# EasyEDA Pro project Logic Connector V1.1.1.epro

# Schematic Version 1.1.1

## Sheets
1 Mode Select: Board Name: <System Assignment>; Create Date: 2025-01-27; Page Name: Mode Select; Project Name: Access Control Logic Connector; Schematic Name: Version 1.0.1; Update Date: 2025-06-26
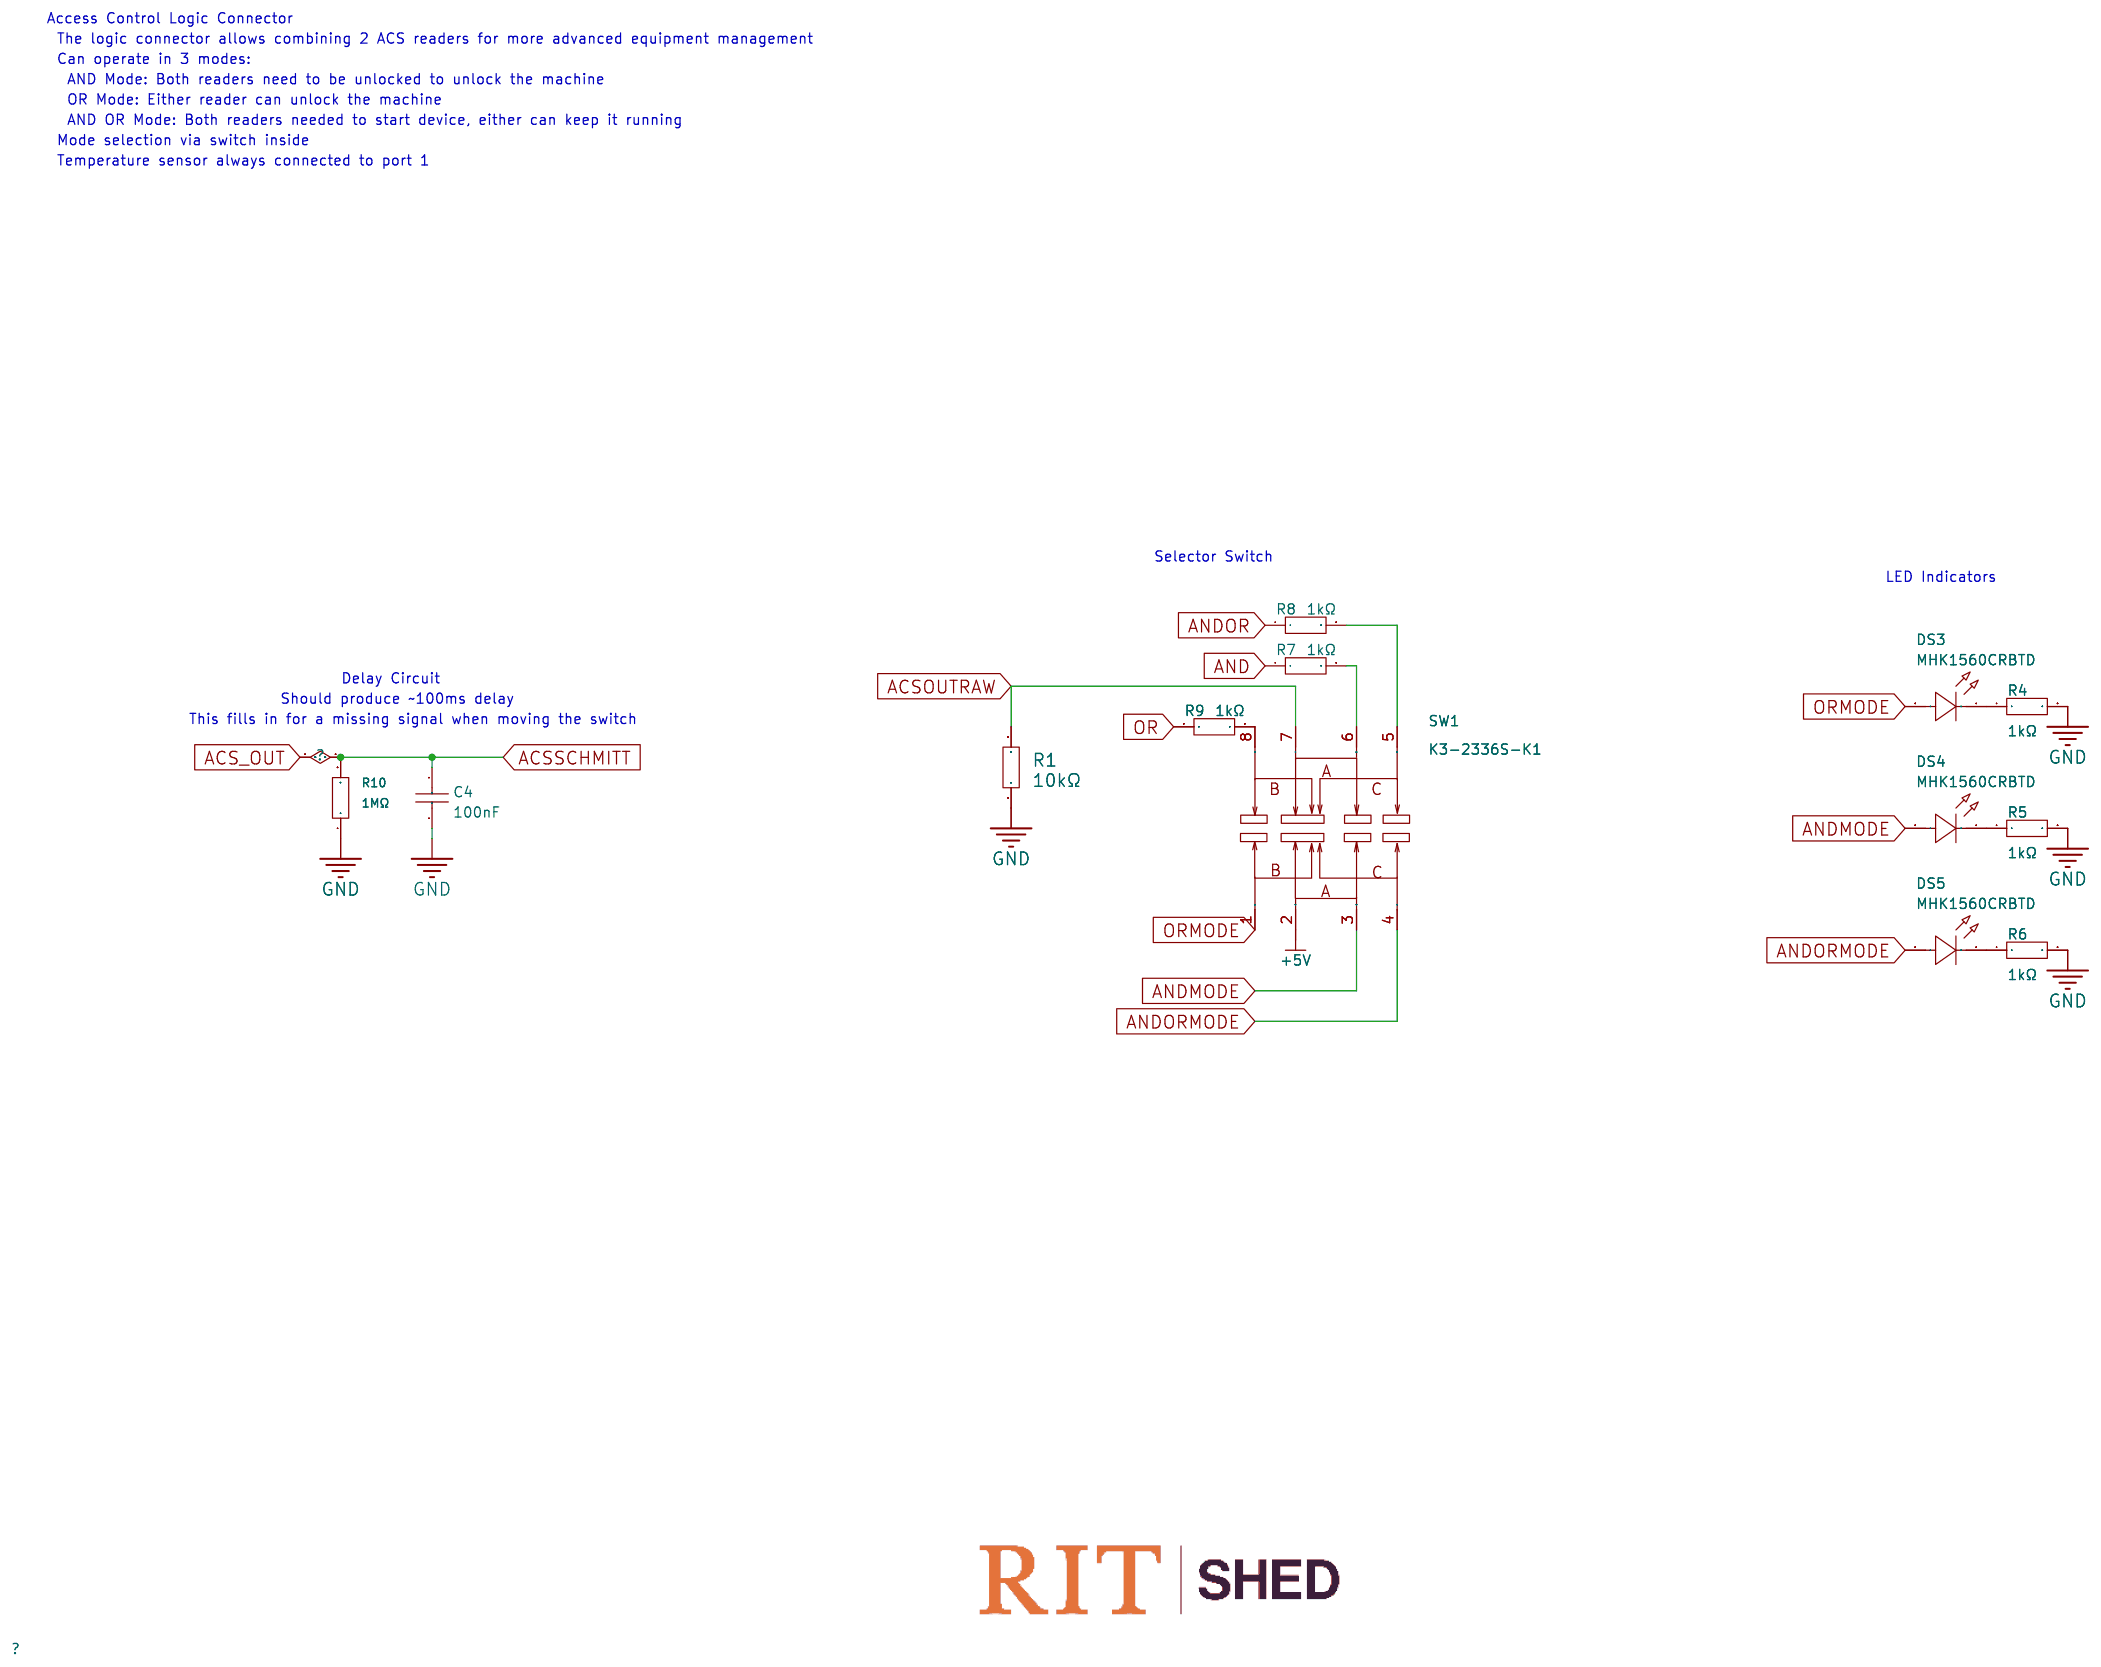
[diagram p0: Mode Select]
2 Connectors: Board Name: Board1; Create Date: 2025-01-28; Page Name: Connectors
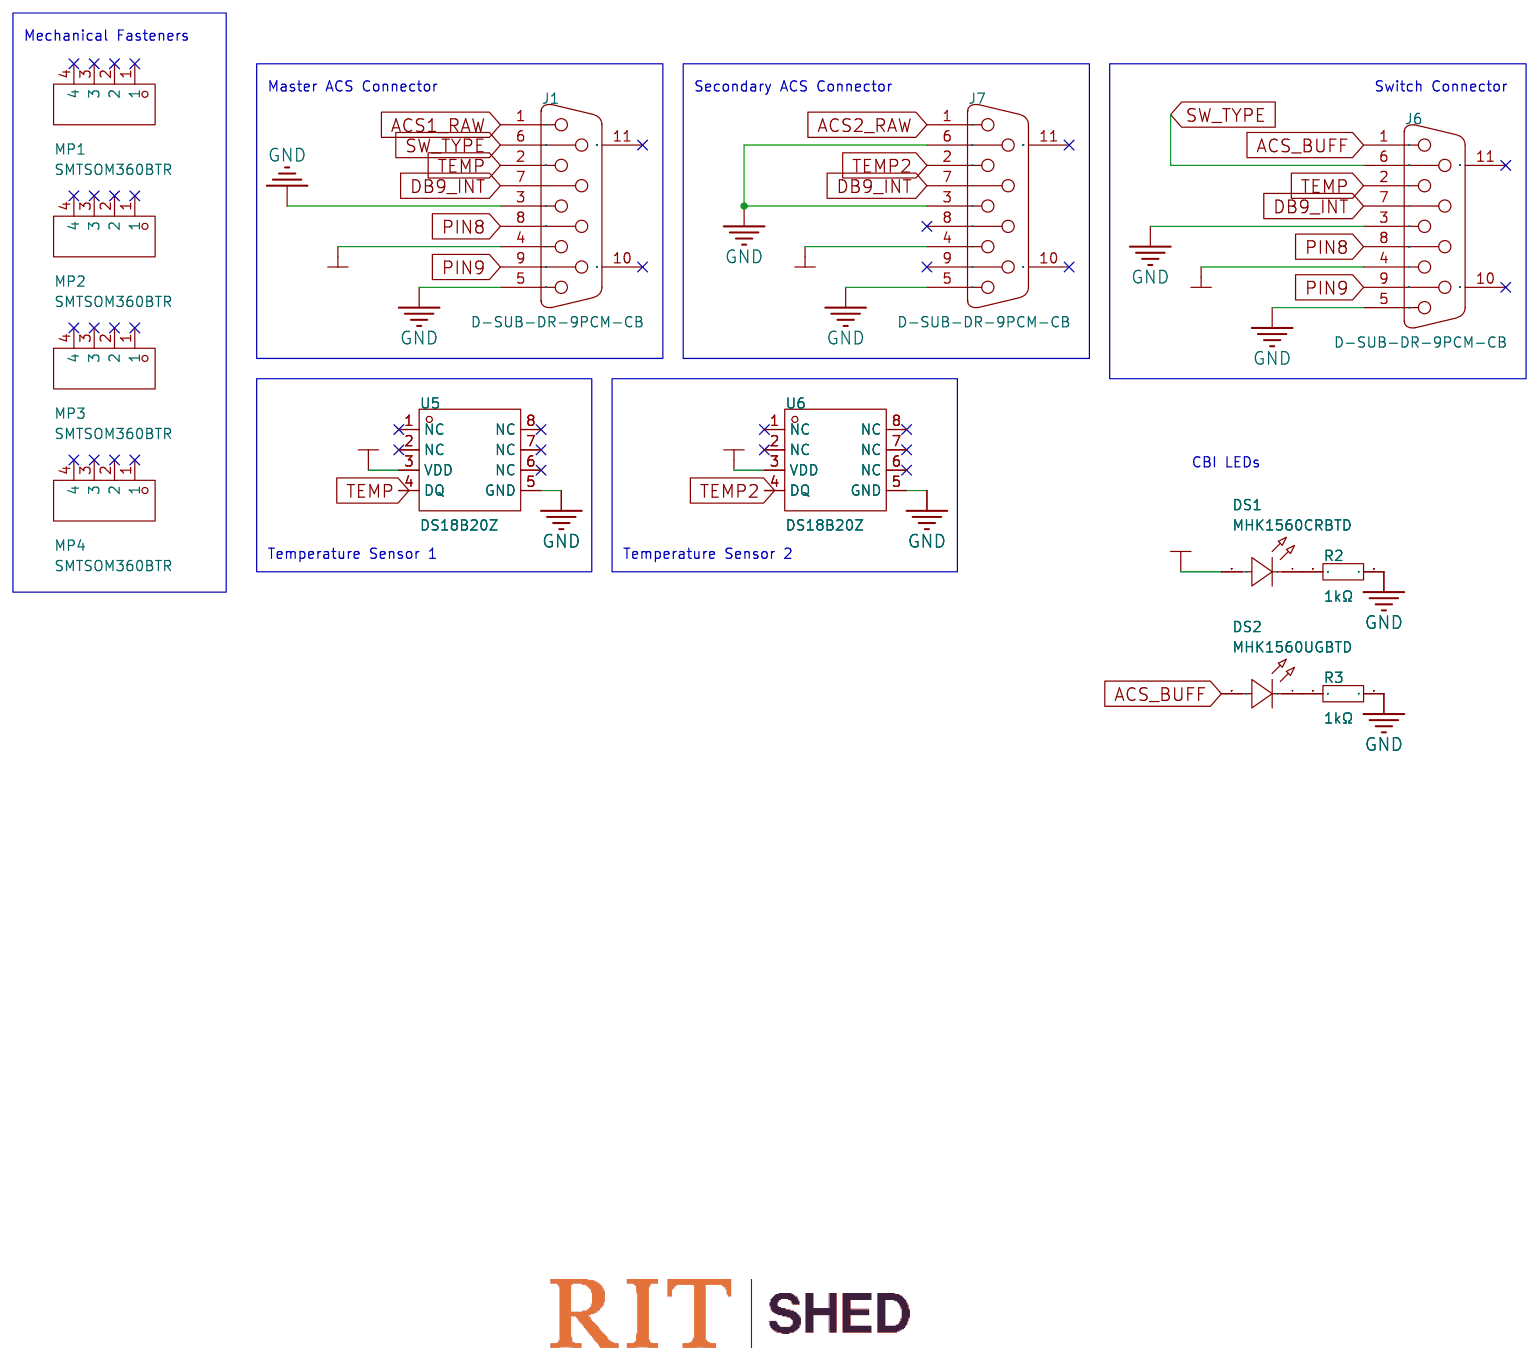
[diagram p1: Connectors]
3 Logic: Board Name: Board1; Create Date: 2025-01-28; Page Name: Logic
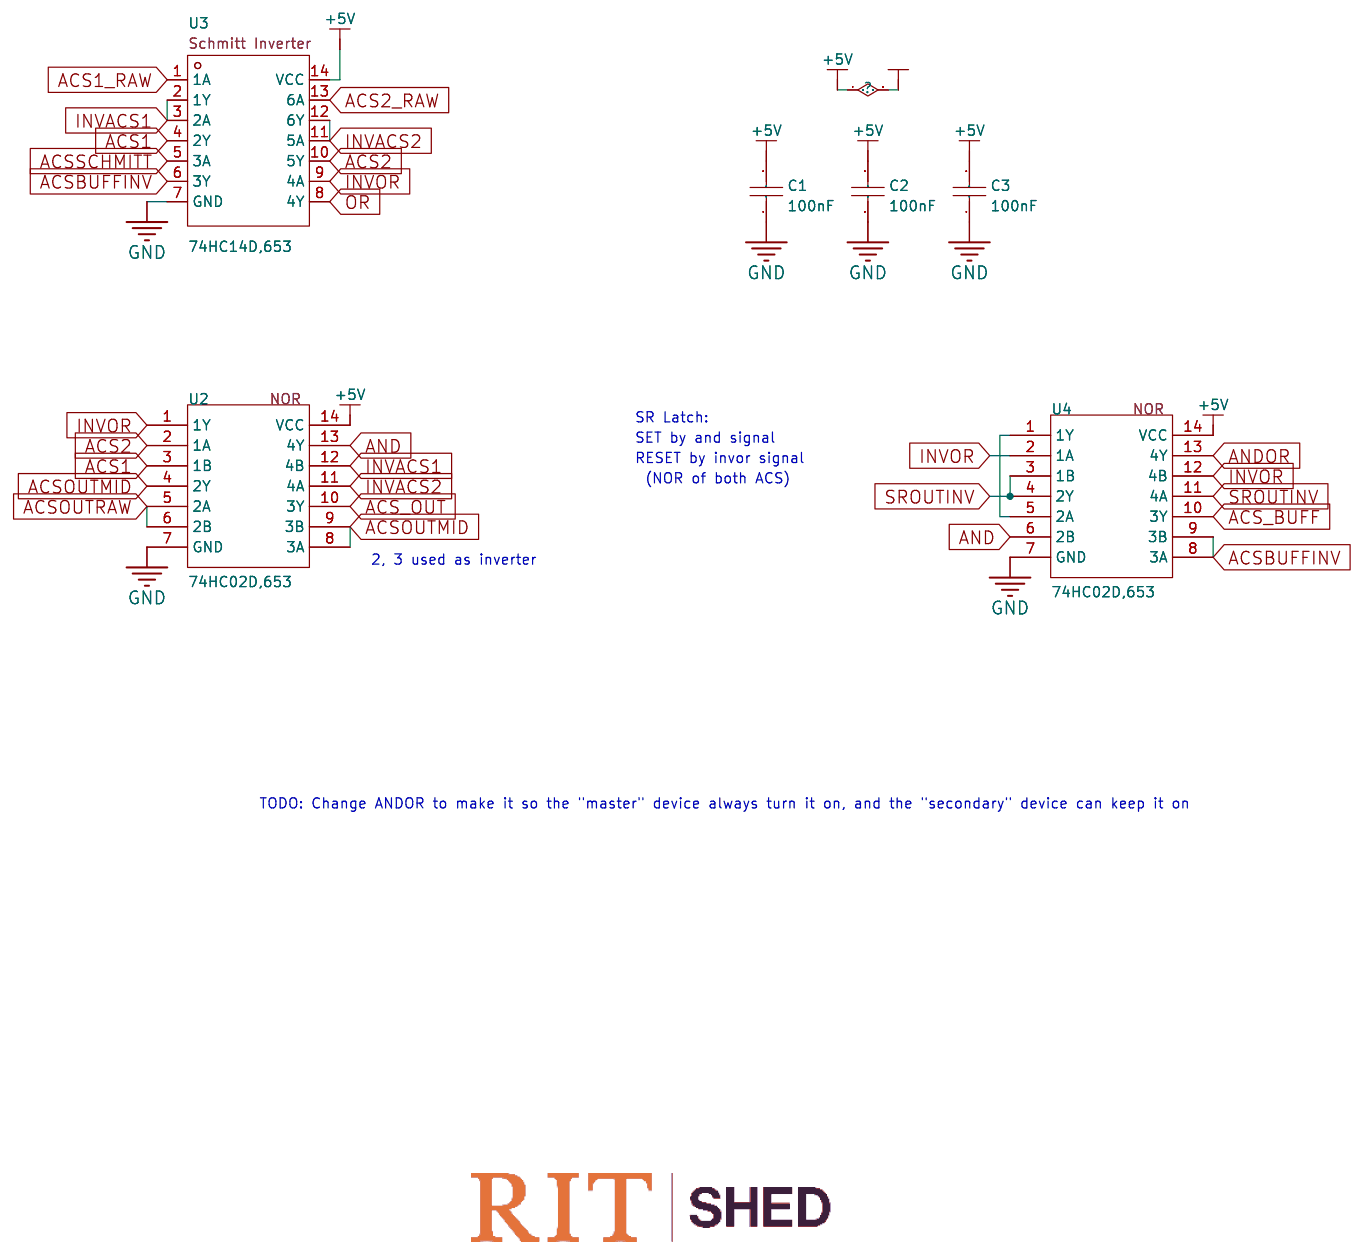
[diagram p2: Logic]

## Parts
sheet Connectors
DS1  MHK1560CRBTD  [LED-TH_MHK1560UGBTD]
DS2  MHK1560UGBTD  [LED-TH_MHK1560UGBTD]
J1  D-SUB-DR-9PCM-CB  [DB9-TH_D-SUB-DR-9PCM-CB]
J6  D-SUB-DR-9PCM-CB  [DB9-TH_D-SUB-DR-9PCM-CB]
J7  D-SUB-DR-9PCM-CB  [DB9-TH_D-SUB-DR-9PCM-CB]
MP1  SMTSOM360BTR  [SMD_BD5.6-D4.1]
MP2  SMTSOM360BTR  [SMD_BD5.6-D4.1]
MP3  SMTSOM360BTR  [SMD_BD5.6-D4.1]
MP4  SMTSOM360BTR  [SMD_BD5.6-D4.1]
R2  1kΩ  [R0805]
R3  1kΩ  [R0805]
U5  DS18B20Z  [SOP-8_L4.9-W3.9-P1.27-LS6.0-BL]
U6  DS18B20Z  [SOP-8_L4.9-W3.9-P1.27-LS6.0-BL]
sheet Logic
C1  100nF  [C0805]
C2  100nF  [C0805]
C3  100nF  [C0805]
U2  74HC02D,653  [SOIC-14_L8.7-W3.9-P1.27-LS6.0-BL]
U3  74HC14D,653  [SOIC-14_L8.7-W3.9-P1.27-LS6.0-BL]
U4  74HC02D,653  [SOIC-14_L8.7-W3.9-P1.27-LS6.0-BL]
sheet Mode Select
C4  100nF  [C0805]
DS3  MHK1560CRBTD  [LED-TH_MHK1560UGBTD]
DS4  MHK1560CRBTD  [LED-TH_MHK1560UGBTD]
DS5  MHK1560CRBTD  [LED-TH_MHK1560UGBTD]
R1  10kΩ  [R0805]
R4  1kΩ  [R0805]
R5  1kΩ  [R0805]
R6  1kΩ  [R0805]
R7  1kΩ  [R0805]
R8  1kΩ  [R0805]
R9  1kΩ  [R0805]
R10  1MΩ  [R0805]
SW1  K3-2336S-K1  [SW-SMD_K3-2336S-K1]

## Library data of the parts
DS1 DS3-DS5 = MHK1560CGBTD: 20mA 雾状红透镜 50mcd -40℃~+85℃ 632nm Red 85° 1.75V~2.2V Plugin,P=2.54mm Light Emitting Diodes (LED) ROHS; LCSC Part Name: 1560直插单灯翠绿色光; Supplier Part: C7470835; Manufacturer: MEIHUA(美华); Supplier Footprint: 插件,P=2.54mm; JLCPCB Part Class: Extended Part; Datasheet: https://atta.szlcsc.com/upload/public/pdf/source/20231114/0151DB1F997DCF286213A722D08B4BAA.pdf; Supplier: LCSC; Emitted Color: Emerald; Forward Voltage (VF): 1.75V~2.2V; Forward Current: 20mA; Dominant Wavelength: 520nm; Lens Color: 雾状绿透镜; Luminous Intensity: 1000mcd; Viewing Angle: 85°; Operating Temperature: -40℃~+85℃
DS2 = MHK1560UGBTD: Emitted Color:Emerald Forward Voltage (VF):1.75V~2.2V Forward Voltage (VF):1.75V~2.2V Forward Current:20mA Dominant Wavelength:520nm Dominant Wavelength:520nm Lens Color:雾状绿透镜 Luminous Intensity:1000mcd Luminous Intensity:1000mcd Viewing Angle:85° Operati; LCSC Part Name: 1560直插单灯翠绿色光; Supplier Part: C7470833; Manufacturer: MEIHUA(美华); Supplier Footprint: 插件,P=2.54mm; JLCPCB Part Class: Extended Part; Datasheet: https://atta.szlcsc.com/upload/public/pdf/source/20231114/0151DB1F997DCF286213A722D08B4BAA.pdf; Supplier: LCSC; Emitted Color: Emerald; Forward Voltage (VF): 1.75V~2.2V; Forward Current: 20mA; Dominant Wavelength: 520nm; Lens Color: 雾状绿透镜; Luminous Intensity: 1000mcd; Viewing Angle: 85°; Operating Temperature: -40℃~+85℃
J1 J6 J7 = D-SUB-DR-9PCM-CB: Gender:Mother Number of Pins:9P Mounting Style:Bend-in Number of Rows:2 Current Rating-Signal (Max):3A Operating Temperature Range:-50℃~+105℃ Operating Temperature Range:-50℃~+105℃; LCSC Part Name: D-Sub 母 P数:9P; Supplier Part: C19077337; Manufacturer: XUNPU(讯普); Supplier Footprint: 弯插; JLCPCB Part Class: Extended Part; Datasheet: https://atta.szlcsc.com/upload/public/pdf/source/20231108/FB2E8AB0BE4F620DDF3F7F4D0B9AFB97.pdf; Supplier: LCSC; Gender: Mother; Number of Pins: 9P; Mounting Style: Bend-in; Number of Rows: 2; Operating Temperature Range: -50℃~+105℃; Current Rating-Signal (Max): 3A
MP1-MP4 = SMTSOM360BTR: LCSC Part Name: YIYUAN(怡远)M3贴片螺母 铜镀锡 PCB贴片连接器SMTSOM360BTR; Supplier Part: C5221846; Manufacturer: YIYUAN(怡远); JLCPCB Part Class: Extended Part; Datasheet: https://atta.szlcsc.com/upload/public/pdf/source/20230202/A42D22DA7D93D728E13784C4003E4077.pdf; Supplier: LCSC
R2-R9 = 0805W8F1001T5E: Type:Thick Film Resistors Resistance:1kΩ Tolerance:±1% Tolerance:±1% Power(Watts): Overload Voltage (Max): Temperature Coefficient:±100ppm/℃ Temperature Coefficient:±100ppm/℃ Operating Temperature Range:-55℃~+155℃ Operating Temperature Range:-55℃~+155℃; LCSC Part Name: 1kΩ ±1% 125mW 厚膜电阻; Supplier Part: C17513; Manufacturer: UNI-ROYAL(厚声); Supplier Footprint: 0805; Datasheet: https://atta.szlcsc.com/upload/public/pdf/source/20200306/C422600_1E6D84923E4A46A82E41ADD87F860B5C.pdf; Supplier: LCSC; Type: Thick Film Resistors; Tolerance: ±1%; Temperature Coefficient: ±100ppm/℃; Operating Temperature Range: -55℃~+155℃
U5 U6 = DS18B20Z: Resolution:±0.4℃ Resolution:±0.4℃ Supply Voltage:2.5V~5.5V Supply Voltage:2.5V~5.5V; LCSC Part Name: 温度传感器; Supplier Part: C695837; Manufacturer: UMW(友台半导体); Supplier Footprint: SOIC-8; JLCPCB Part Class: Extended Part; Datasheet: https://atta.szlcsc.com/upload/public/pdf/source/20231109/DC3DA9D47D486EF40A6E0F08B9A498E3.pdf; Supplier: LCSC; Resolution: ±0.4℃; Supply Voltage: 2.5V~5.5V
C1-C4 = CL21B104KCFNNNE: Capacitance: Tolerance:±10% Tolerance:±10% Voltage Rated: Temperature Coefficient:; LCSC Part Name: 100nF ±10% 100V; Supplier Part: C28233; Manufacturer: SAMSUNG(三星); Supplier Footprint: 0805; JLCPCB Part Class: Basic Part; Datasheet: https://atta.szlcsc.com/upload/public/pdf/source/20160218/1457707763339.pdf; Supplier: LCSC; Tolerance: ±10%
U2 U4 = 74HC02D,653: Logic Gate Type:NORGate Number of Channels:4 Supply Voltage:2V~6V Supply Voltage:2V~6V Quiescent Current (Max):2uA Sink Current:5.2mA Source Current:5.2mA High Level Range (VIH):1.5V~4.2V High Level Range (VIH):1.5V~4.2V Low Level Range (VIL):500mV~1.8V L; Supplier Part: C5588; Manufacturer: Nexperia(安世); Supplier Footprint: SOIC-14; Datasheet: https://atta.szlcsc.com/upload/public/pdf/source/20170225/1488010654689.pdf; Supplier: LCSC; Logic Gate Type: NOR; Number of Channels: 4; Supply Voltage: 2V~6V; Quiescent Current (Max): 2uA; Sink Current: 5.2mA; Source Current: 5.2mA; High Level Range (VIH): 1.5V~4.2V; Low Level Range (VIL): 500mV~1.8V; Series: 74HCSeries; Propagation Delay Time: 15ns@6V,50pF; Operating Temperature: -40℃~+125℃
U3 = 74HC14D,653: Input Type:Schmitt Trigger Supply Voltage(Single):2V~6V Supply Voltage(Single):2V~6V Supply Current (Max):2uA Number of Circuits:6 Number of Inputs:1 Sink Current:5.2mA Source Current:5.2mA High level range (VIH):1.5V~4.2V High level range (VIH):1.5V~4.2V; LCSC Part Name: 六路施密特触发反相器; Supplier Part: C5605; Manufacturer: Nexperia(安世); Supplier Footprint: SOIC-14; Datasheet: https://atta.szlcsc.com/upload/public/pdf/source/20240724/EDEB5B2454CA09835E17810C4B06A75D.pdf; Supplier: LCSC; Input Type: Schmitt Inverter; Supply Voltage(Single): 2V~6V; Supply Current (Max): 2uA; Number of Circuits: 6; Number of Inputs: 1; Sink Current: 5.2mA; Source Current: 5.2mA; High level range (VIH): 1.5V~4.2V; Low level range (VIL): 300mV~1.2V; Max Propagation Delay: 21ns@6V,50pF; Series: 74HCSeries; Operating Temperature: -40℃~+125℃
R1 = 0805W8F1002T5E: Type:Thick Film Resistors Resistance:10kΩ Tolerance:±1% Tolerance:±1% Power(Watts): Overload Voltage (Max): Temperature Coefficient:±100ppm/℃ Temperature Coefficient:±100ppm/℃ Operating Temperature Range:-55℃~+155℃ Operating Temperature Range:-55℃~+155℃; LCSC Part Name: 10kΩ ±1% 125mW 厚膜电阻; Supplier Part: C17414; Manufacturer: UNI-ROYAL(厚声); Supplier Footprint: 0805; JLCPCB Part Class: Basic Part; Datasheet: https://atta.szlcsc.com/upload/public/pdf/source/20200306/C422600_1E6D84923E4A46A82E41ADD87F860B5C.pdf; Supplier: LCSC; Type: Thick Film Resistors; Tolerance: ±1%; Temperature Coefficient: ±100ppm/℃; Operating Temperature Range: -55℃~+155℃
R10 = 0805W8F1004T5E: Type:Thick Film Resistors Resistance:1MΩ Tolerance:±1% Tolerance:±1% Power(Watts): Overload Voltage (Max): Temperature Coefficient:±100ppm/℃ Temperature Coefficient:±100ppm/℃ Operating Temperature Range:-55℃~+155℃ Operating Temperature Range:-55℃~+155℃; LCSC Part Name: 1MΩ ±1% 125mW 厚膜电阻; Supplier Part: C17514; Manufacturer: UNI-ROYAL(厚声); Supplier Footprint: 0805; Datasheet: https://atta.szlcsc.com/upload/public/pdf/source/20200306/C422600_1E6D84923E4A46A82E41ADD87F860B5C.pdf; Supplier: LCSC; Type: Thick Film Resistors; Tolerance: ±1%; Temperature Coefficient: ±100ppm/℃; Operating Temperature Range: -55℃~+155℃
SW1 = K3-2336S-K1: Circuit:双刀三掷 Actuator Style:Rectangular columnar Pin Style:Gull Wing Switch Length:13mm Switch Width:3.5mm Switch Height:3.5mm Mounting Style:Brick nogging Actuator Color:Black Current Rating (DC):300mA Voltage Rating (DC):6V Current Rating (AC):- Voltage; LCSC Part Name: 立贴三档 滑动开关; Supplier Part: C145840; Manufacturer: 韩国韩荣; Supplier Footprint: SMD; Datasheet: https://atta.szlcsc.com/upload/public/pdf/source/20210810/38444E7D6D5CD92570837A6EA51AB202.pdf; Supplier: LCSC; Circuit: 双刀三掷; Actuator Style: Rectangular columnar; Pin Style: Gull Wing; Switch Length: 13mm; Switch Width: 3.5mm; Switch Height: 3.5mm; Mounting Style: Brick nogging; Actuator Color: Black; Current Rating (DC): 300mA; Voltage Rating (DC): 6V; Mechanical Life: 1万次; Operating Temperature: -25℃~+80℃

## Nets
+5V: C1.2 C2.2 C3.2 DS1.2(A) J1.4 J6.4 J7.4 SW1.2 U2.14(VCC) U3.14(VCC) U4.14(VCC) U5.3(VDD) U6.3(VDD)
GND: C1.1 C2.1 C3.1 C4.1 J1.3 J1.5 J6.3 J6.5 J7.3 J7.5 J7.6 R1.1 R2.2 R3.2 R4.2 R5.2 R6.2 R10.1 U2.7(GND) U3.7(GND) U4.7(GND) U5.5(GND) U6.5(GND)
ACS1: U2.3(1B) U3.4(2Y)
ACS1_RAW: J1.1 U3.1(1A)
ACS2: U2.2(1A) U3.10(5Y)
ACS2_RAW: J7.1 U3.13(6A)
ACS_BUFF: DS2.2(A) J6.1 U4.10(3Y)
ACSBUFFINV: U3.6(3Y) U4.8(3A) U4.9(3B)
ACSOUTMID: U2.4(2Y) U2.8(3A) U2.9(3B)
ACSOUTRAW: R1.2 SW1.7 U2.5(2A) U2.6(2B)
ACSSCHMITT: C4.2 R10.2 U2.10(3Y) U3.5(3A)
AND: R7.1 U2.13(4Y) U4.6(2B)
ANDMODE: DS4.2(A) SW1.3
ANDOR: R8.1 U4.13(4Y)
ANDORMODE: DS5.2(A) SW1.4
DB9_INT: J1.7 J6.7 J7.7
INVACS1: U2.12(4B) U3.2(1Y) U3.3(2A)
INVACS2: U2.11(4A) U3.11(5A) U3.12(6Y)
INVOR: U2.1(1Y) U3.9(4A) U4.2(1A) U4.12(4B)
OR: R9.1 U3.8(4Y)
ORMODE: DS3.2(A) SW1.1
PIN8: J1.8 J6.8
PIN9: J1.9 J6.9
SROUTINV: U4.3(1B) U4.4(2Y) U4.11(4A)
SW_TYPE: J1.6 J6.6
TEMP: J1.2 J6.2 U5.4(DQ)
TEMP2: J7.2 U6.4(DQ)
$1N429: R7.2 SW1.6
$1N435: R8.2 SW1.5
$1N896: DS3.1(K) R4.1
$1N1033: DS4.1(K) R5.1
$1N1123: DS5.1(K) R6.1
$1N1288: R9.2 SW1.8
$2N1571: DS1.1(K) R2.1
$2N1653: DS2.1(K) R3.1
$3N978: U4.1(1Y) U4.5(2A)

Not connected (* = marked no-connect by the designer): J1 10(MH1)* 11(MH2)*; J6 10(MH1)* 11(MH2)*; J7 8* 9* 10(MH1)* 11(MH2)*; MP1 1* 2* 3* 4*; MP2 1* 2* 3* 4*; MP3 1* 2* 3* 4*; MP4 1* 2* 3* 4*; U5 1(NC)* 2(NC)* 6(NC)* 7(NC)* 8(NC)*; U6 1(NC)* 2(NC)* 6(NC)* 7(NC)* 8(NC)*

## Notes on the sheets
sheet 1
- Access Control Logic Connector
- The logic connector allows combining 2 ACS readers for more advanced equipment management
- Can operate in 3 modes:
- AND Mode: Both readers need to be unlocked to unlock the machine
- OR Mode: Either reader can unlock the machine
- AND OR Mode: Both readers needed to start device, either can keep it running
- Mode selection via switch inside
- Temperature sensor always connected to port 1
- Selector Switch
- LED Indicators
- Delay Circuit
- Should produce ~100ms delay
- This fills in for a missing signal when moving the switch
sheet 2
- Mechanical Fasteners
- Master ACS Connector
- Secondary ACS Connector
- Switch Connector
- CBI LEDs
- Temperature Sensor 1
- Temperature Sensor 2
sheet 3
- SET by and signal
- SR Latch:
- RESET by invor signal
- (NOR of both ACS)
- 2, 3 used as inverter
- TODO: Change ANDOR to make it so the "master" device always turn it on, and the "secondary" device can keep it on

# Board V1.1.1 PCB
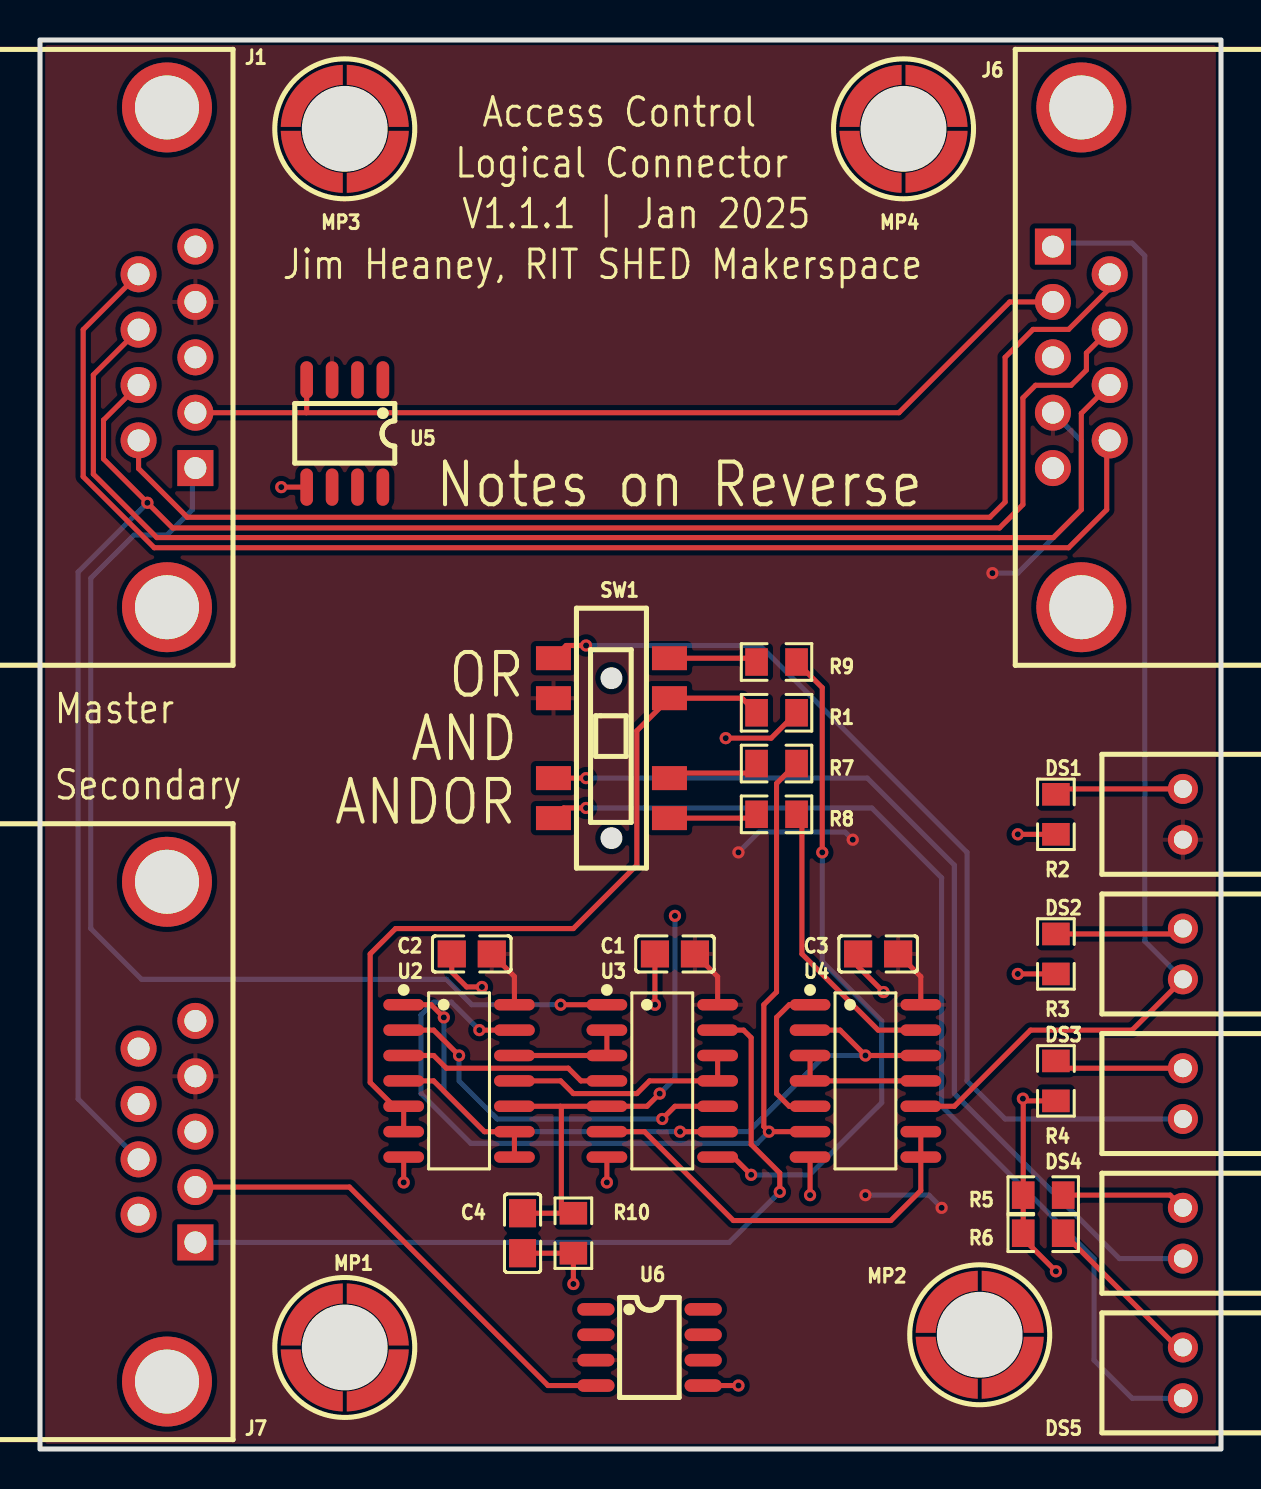
[diagram p3: board, top side]
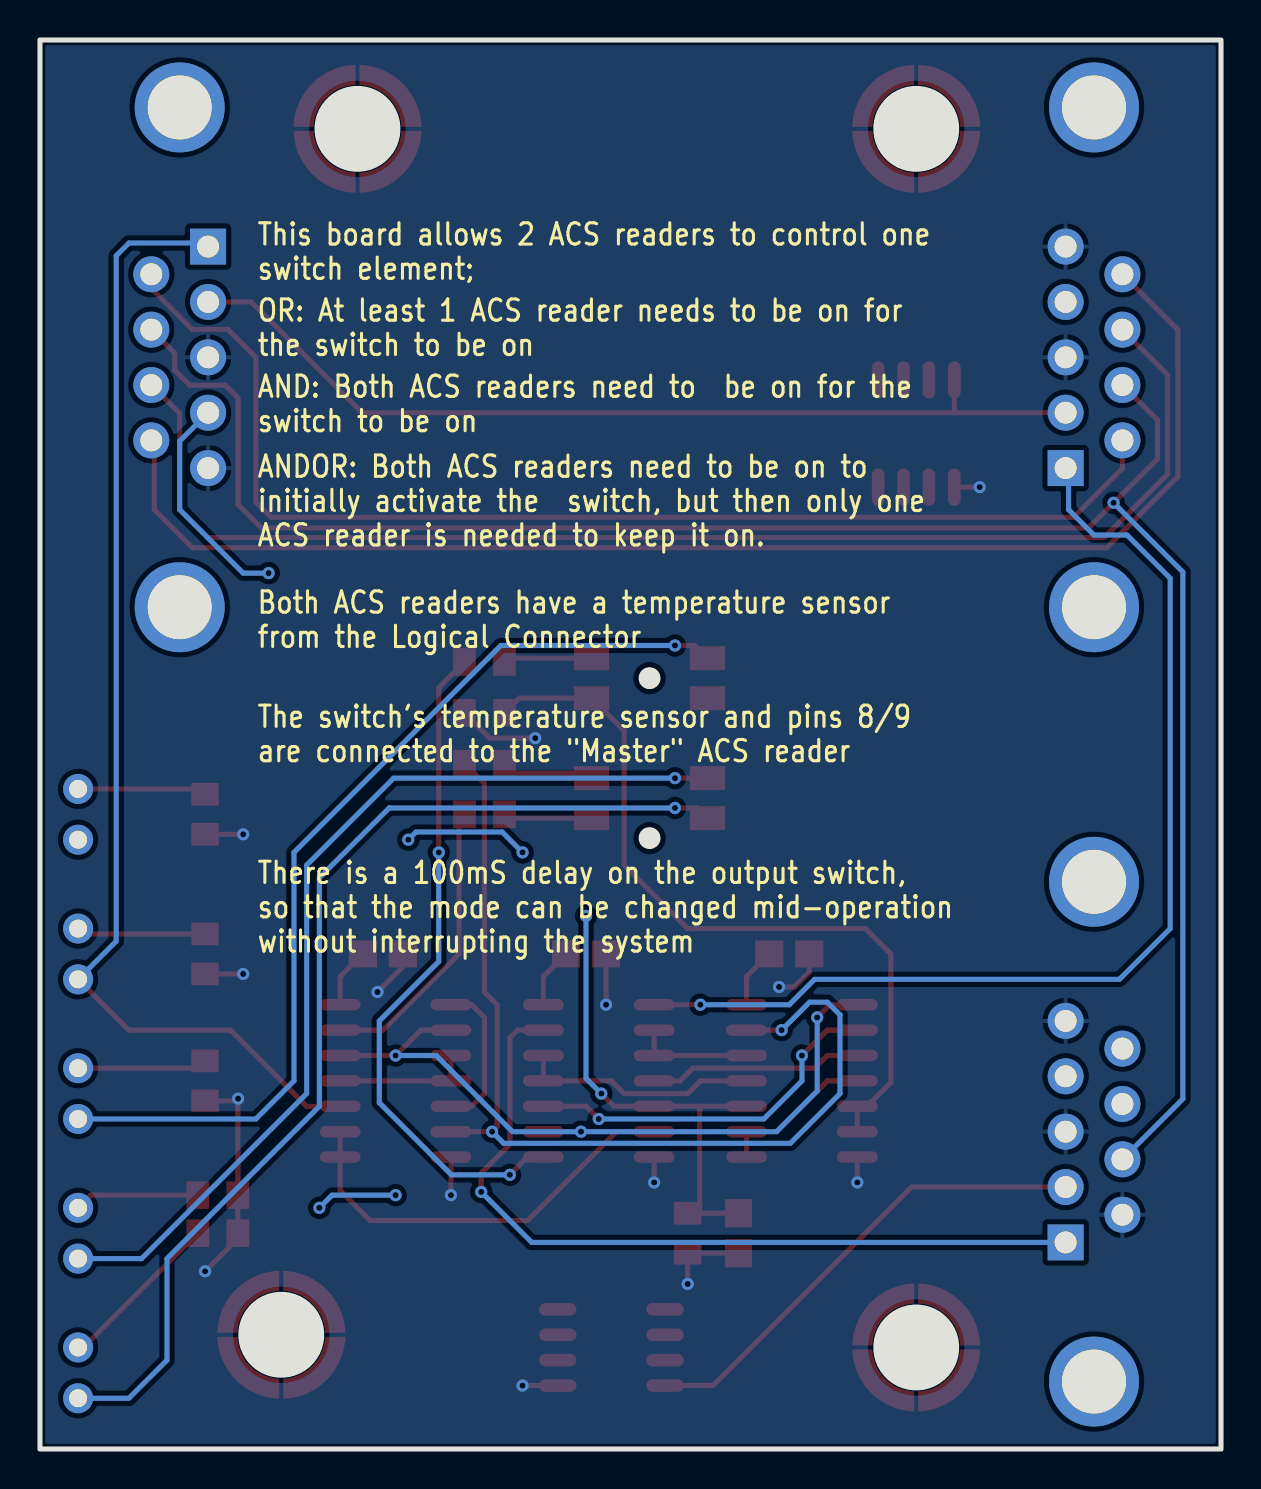
[diagram p4: board, bottom side, seen from below]

Outline 59.06 x 70.48 mm; copper layers: Top Layer, Bottom Layer. Coordinates in mm from the lower left corner of the outline.
Outline path: rectangle 0,70.48 59.06,0
Stack: Top Layer 0.035mm / Dielectric1 1.51mm FR4 er 4.5 / Bottom Layer 0.035mm

## Design rules (mm)
template: JLCPCB Capability(Two Layers Board)
spacing copperThickness1oz (default): track to track 0.102, other pairs 0.152 to 0.3
spacing copperThickness2oz: track to track 0.203, other pairs 0.152 to 0.3
track width copperThickness1oz (default): min 0.127, default 0.254, max 2.54
track width copperThickness2oz: min 0.203, default 0.254, max 2.54
differential pair differentialPair (default): width min 0.127, default 0.254, max 2.54; gap min 0.152, default 0.152
via viaSize (default): diameter min 0.5, default 0.61, max 10; hole min 0.3, default 0.305, max 6.3

## Placement (name value [footprint] x y rotation side)
C1  100nF  [C0805]  31.75 24.77 0 top
C2  100nF  [C0805]  21.59 24.77 0 top
C3  100nF  [C0805]  41.91 24.77 0 top
C4  100nF  [C0805]  24.13 10.79 90 top
DS1  MHK1560CRBTD  [LED-TH_MHK1560UGBTD]  57.15 31.75 90 top
DS2  MHK1560UGBTD  [LED-TH_MHK1560UGBTD]  57.15 24.77 90 top
DS3  MHK1560CRBTD  [LED-TH_MHK1560UGBTD]  57.15 17.78 90 top
DS4  MHK1560CRBTD  [LED-TH_MHK1560UGBTD]  57.15 10.79 90 top
DS5  MHK1560CRBTD  [LED-TH_MHK1560UGBTD]  57.15 3.81 90 top
J1  D-SUB-DR-9PCM-CB  [DB9-TH_D-SUB-DR-9PCM-CB]  6.35 54.61 270 top
J6  D-SUB-DR-9PCM-CB  [DB9-TH_D-SUB-DR-9PCM-CB]  52.07 54.61 90 top
J7  D-SUB-DR-9PCM-CB  [DB9-TH_D-SUB-DR-9PCM-CB]  6.35 15.88 270 top
MP1  SMTSOM360BTR  [SMD_BD5.6-D4.1]  15.24 5.08 0 top
MP2  SMTSOM360BTR  [SMD_BD5.6-D4.1]  46.99 5.72 0 top
MP3  SMTSOM360BTR  [SMD_BD5.6-D4.1]  15.24 66.04 0 top
MP4  SMTSOM360BTR  [SMD_BD5.6-D4.1]  43.18 66.04 0 top
R1  10kΩ  [R0805]  36.83 36.83 180 top
R2  1kΩ  [R0805]  50.8 31.75 270 top
R3  1kΩ  [R0805]  50.8 24.77 270 top
R4  1kΩ  [R0805]  50.8 18.41 270 top
R5  1kΩ  [R0805]  50.16 12.7 180 top
R6  1kΩ  [R0805]  50.16 10.79 180 top
R7  1kΩ  [R0805]  36.83 34.29 180 top
R8  1kΩ  [R0805]  36.83 31.75 180 top
R9  1kΩ  [R0805]  36.83 39.37 180 top
R10  1MΩ  [R0805]  26.67 10.79 90 top
SW1  K3-2336S-K1  [SW-SMD_K3-2336S-K1]  28.58 35.56 270 top
U2  74HC02D,653  [SOIC-14_L8.7-W3.9-P1.27-LS6.0-BL]  20.96 18.41 270 top
U3  74HC14D,653  [SOIC-14_L8.7-W3.9-P1.27-LS6.0-BL]  31.12 18.41 270 top
U4  74HC02D,653  [SOIC-14_L8.7-W3.9-P1.27-LS6.0-BL]  41.28 18.41 270 top
U5  DS18B20Z  [SOP-8_L4.9-W3.9-P1.27-LS6.0-BL]  15.24 50.8 180 top
U6  DS18B20Z  [SOP-8_L4.9-W3.9-P1.27-LS6.0-BL]  30.48 5.08 270 top

## Footprints (pads in the part's own frame, mm; a bottom-side part is the same pattern mirrored in y, then rotated)
C0805
  rect 1.41x1.35 smd: 1(-1,0) 2(1,0)
DB9-TH_D-SUB-DR-9PCM-CB
  rect 1.8x1.8 hole 1.1: 1(5.54,1.42)
  round 1.8 hole 1.1: 2(2.77,1.42) 3(0,1.42) 4(-2.77,1.42) 5(-5.54,1.42) 6(4.155,-1.42) 7(1.385,-1.42) 8(-1.385,-1.42) 9(-4.155,-1.42)
  round 4.5 hole 3.2: 10(-12.5,0) 11(12.5,0)
LED-TH_MHK1560UGBTD
  round 1.5 hole 0.9: 1(1.27,0) 2(-1.27,0)
R0805
  rect 1.133x1.377 smd: 1(-1,0) 2(1,0)
SMD_BD5.6-D4.1
  custom 3.1x3.1 smd: 1(-2.102,1.65) 2(1.65,2.102) 3(2.102,-1.65) 4(-1.65,-2.102)
SOIC-14_L8.7-W3.9-P1.27-LS6.0-BL
  oval 0.574x2.038 smd: 1(-3.81,-2.769) 2(-2.54,-2.769) 3(-1.27,-2.769) 4(0,-2.769) 5(1.27,-2.769) 6(2.54,-2.769) 7(3.81,-2.769) 8(3.81,2.769) 9(2.54,2.769) 10(1.27,2.769) 11(0,2.769) 12(-1.27,2.769) 13(-2.54,2.769) 14(-3.81,2.769)
SOP-8_L4.9-W3.9-P1.27-LS6.0-BL
  oval 0.63x1.865 smd: 1(-1.905,-2.683) 2(-0.635,-2.683) 3(0.635,-2.683) 4(1.905,-2.683) 5(1.905,2.683) 6(0.635,2.683) 7(-0.635,2.683) 8(-1.905,2.683)
SW-SMD_K3-2336S-K1
  rect 1.2x1.75 smd: 1(-4,-2.9) 2(-2,-2.9) 3(2,-2.9) 4(4,-2.9) 5(4,2.9) 6(2,2.9) 7(-2,2.9) 8(-4,2.9)

## Nets
As in the schematic.

Pads without a net: J1 10 11; J6 10 11; J7 8 9 10 11; MP1 1 2 3 4; MP2 1 2 3 4; MP3 1 2 3 4; MP4 1 2 3 4; U5 1 2 6 7 8; U6 1 2 6 7 8

## Via types
v1: diameter 0.61, hole 0.305, Top Layer to Bottom Layer, 36 vias

## Routing (per net, layer and track width the routed paths; a pad name or vN(x,y) marks a point on that pad's centre or on a via; arc(x,y) is an arc through that point)
+5V: length 30.6
  Top Layer w0.254: U3.14 33.88,23.63 C1.2 ; U4.14 44.04,23.63 C3.2 ; C2.2 23.72,23.63 U2.14
  Bottom Layer w0.254: J6.4 52.07,50.42 52.07,46.99 48.9,43.81 v1(47.62,43.81) ; v1(40.64,30.48) 40.26,30.86 35.94,30.86 v1(34.93,29.84) ; v1(45.09,12.06) 44.45,12.7 v1(41.28,12.7)
GND: length 38.1
  Top Layer w0.254: C3.1 40.91,24.13 v1(42.18,22.86) ; v1(34.29,35.56) 36.56,35.56 R1.1 ; U2.7 v1(18.19,13.33) ; C4.1 R10.1 v1(26.67,8.25) ; C2.1 20.59,23.86 21.34,23.11 v1(22.1,23.11) ; U3.7 v1(28.35,13.33) ; R4.2 49.26,17.41 49.16,17.51 ; U4.7 v1(38.51,12.7) ; R2.2 v1(48.9,30.75) ; U6.5 v1(34.93,3.18) ; R3.2 v1(48.9,23.77) ; U5.5 v1(12.06,48.12) ; v1(50.8,8.89) 49.16,10.53 R6.2 R5.2 49.16,17.51 ; C1.1 v1(30.75,22.22) ; 49.16,17.51 v1(49.15,17.53)
ACS1: length 10.7
  Top Layer w0.254: U3.4 27.05,18.41 26.42,19.05 20.32,19.05 19.69,19.69 U2.3
ACS1_RAW: length 53.6
  Top Layer w0.254: U3.1 v1(26.03,22.22)
  Bottom Layer w0.254: J1.1 7.62,48.92 7.62,46.99 6.35,45.72 4.7,45.72 2.54,43.56 2.54,26.03 5.08,23.5 20.32,23.5 21.59,22.22 v1(26.03,22.22)
ACS2: length 18.5
  Top Layer w0.254: v1(20.96,19.69) 19.69,20.95 U2.2 ; U3.10 31.75,17.14 v1(31.12,16.51)
  Bottom Layer w0.254: v1(31.12,16.51) 22.86,16.51 20.96,18.41 v1(20.96,19.69)
ACS2_RAW: length 40.4
  Top Layer w0.254: U3.13 35.18,20.95 35.56,20.57 35.56,15.24 36.99,13.81 v1(36.99,12.86)
  Bottom Layer w0.254: v1(36.99,12.86) 34.47,10.34 J7.1
ACS_BUFF: length 57.7
  Top Layer w0.254: DS2.2 54.61,20.95 49.53,20.95 45.72,17.14 U4.10
  Bottom Layer w0.254: J6.1 50.83,60.33 54.61,60.33 55.25,59.69 55.25,25.4 DS2.2
ACSBUFFINV: length 21.1
  Top Layer w0.254: U4.9 U4.8 44.04,12.93 42.55,11.43 34.67,11.43 30.23,15.88 U3.6
ACSOUTMID: length 7.9
  Top Layer w0.254: U2.8 U2.9 22.22,15.88 19.69,18.41 U2.4
ACSOUTRAW: length 38.7
  Top Layer w0.254: R1.2 35.1,37.56 SW1.7 29.84,35.93 29.84,29.21 26.67,26.03 17.78,26.03 16.51,24.77 16.51,18.34 17.7,17.14 U2.5 U2.6
ACSSCHMITT: length 24.6
  Top Layer w0.254: 26.07,11.79 26.07,17.1 26.02,17.14 ; 26.07,11.79 R10.2 ; 26.07,11.79 C4.2 ; U2.10 26.02,17.14 ; 26.02,17.14 U3.5 30.35,17.14 v1(30.99,17.78)
  Bottom Layer w0.254: v1(30.99,17.78) 31.75,18.54 v1(31.75,26.67)
AND: length 49.4
  Top Layer w0.254: U4.6 v1(36.45,15.88) 36.19,16.13 36.19,22.22 36.83,22.86 36.83,33.29 R7.1 ; U2.13 v1(21.97,20.95)
  Bottom Layer w0.254: v1(36.45,15.88) 35.87,15.29 21.54,15.29 19.05,17.78 19.05,21.72 19.69,22.35 20.57,22.35 v1(21.97,20.95)
ANDMODE: length 48.1
  Top Layer w0.254: SW1.3 v1(27.31,33.56)
  Bottom Layer w0.254: DS4.2 53.97,9.53 45.72,17.78 45.72,29.21 41.37,33.56 v1(27.31,33.56)
ANDOR: length 14.6
  Top Layer w0.254: U4.13 41.91,20.95 38.1,24.77 38.1,31.48 R8.1
ANDORMODE: length 53.6
  Top Layer w0.254: v1(27.31,32.07) 26.18,32.07 SW1.4
  Bottom Layer w0.254: v1(27.31,32.07) 41.59,32.07 45.09,28.58 45.09,17.14 52.71,9.53 52.71,4.44 54.61,2.54 DS5.2
DB9_INT: length 99.4
  Top Layer w0.254: J6.7 52.32,54.83 52.32,53.97 51.56,53.21 49.78,53.21 49.15,52.58 49.15,47.24 47.98,46.08 6.63,46.08 v1(5.37,47.33) 3.18,49.53 3.18,51.47 J1.7
  Bottom Layer w0.254: v1(5.37,47.33) 1.91,43.87 1.91,17.52 J7.7
INVACS1: length 5.9
  Top Layer w0.254: U2.12 U3.3 U3.2
INVACS2: length 12
  Top Layer w0.254: U3.12 U3.11 30.48,18.41 29.84,17.78 26.67,17.78 26.03,18.41 U2.11
INVOR: length 37.4
  Top Layer w0.254: v1(32,15.88) U3.9 ; U4.12 v1(41.28,19.69) 40,20.95 U4.2 ; U2.1 19.56,22.22 v1(20.19,21.59)
  Bottom Layer w0.254: v1(41.28,19.69) 39.24,19.69 35.43,15.88 v1(32,15.88) 22.22,15.88 20.19,17.91 v1(20.19,21.59)
OR: length 33.9
  Top Layer w0.254: v1(35.56,13.72) 34.67,14.61 U3.8 ; R9.1 39.12,38.08 v1(39.12,29.84)
  Bottom Layer w0.254: v1(39.12,29.84) 39.12,24.38 42.09,21.41 42.09,17.32 38.48,13.72 v1(35.56,13.72)
ORMODE: length 48.2
  Top Layer w0.254: SW1.1 26.31,40.19 v1(27.31,40.19)
  Bottom Layer w0.254: DS3.2 48.26,16.51 46.36,18.41 46.36,29.84 36,40.19 v1(27.31,40.19)
PIN8: length 66.3
  Top Layer w0.254: J6.8 52.07,51.8 52.07,46.99 50.67,45.59 5.84,45.59 2.67,48.77 2.67,53.73 J1.8
PIN9: length 68.2
  Top Layer w0.254: J6.9 53.34,50.3 53.34,46.99 51.44,45.08 5.72,45.08 2.16,48.64 2.16,55.99 J1.9
SROUTINV: length 6.8
  Top Layer w0.254: U4.11 U4.4 U4.3
SW_TYPE: length 60.7
  Top Layer w0.254: J1.6 4.93,49.05 7.37,46.61 47.5,46.61 48.26,47.37 48.26,54.61 49.66,56.01 51.44,56.01 53.49,58.06 J6.6
TEMP: length 46.8
  Top Layer w0.254: J6.2 48.49,57.38 42.95,51.84 13.32,51.84 ; 13.32,51.84 13.34,51.86 U5.4 ; 13.32,51.84 J1.2
TEMP2: length 24.1
  Top Layer w0.254: U6.4 25.4,3.18 15.47,13.11 J7.2
$1N429: length 4.7
  Top Layer w0.254: R7.2 35.35,33.81 31.73,33.81 SW1.6
$1N435: length 4.4
  Top Layer w0.254: R8.2 35.64,31.56 SW1.5
$1N896: length 6.5
  Top Layer w0.254: DS3.1 51.16,19.05 R4.1
$1N1033: length 6.2
  Top Layer w0.254: R5.1 56.52,12.7 DS4.1
$1N1123: length 8.4
  Top Layer w0.254: R6.1 56.88,5.08 57.15,5.08
$1N1288: length 4.4
  Top Layer w0.254: R9.2 35.64,39.56 SW1.8
$2N1571: length 6.5
  Top Layer w0.254: DS1.1 51.07,33.02 R2.1
$2N1653: length 6.5
  Top Layer w0.254: DS2.1 56.88,25.77 R3.1
$3N978: length 7.7
  Top Layer w0.254: U4.1 37.47,22.22 36.83,21.59 36.83,17.78 37.47,17.14 U4.5

## Copper pours and planes (outline as drawn; the poured copper is in the pictures)
+5V on Top Layer: -9.52,76.84 67.94,76.84 67.94,-6.99 -9.52,-6.99
GND on Bottom Layer: -5.08,88.9 62.87,88.9 62.87,-15.24 -5.08,-15.24

## Text on the board
Bottom Silkscreen Layer: This board allows 2 ACS readers to control one / switch element; | OR: At least 1 ACS reader needs to be on for / the switch to be on | AND: Both ACS readers need to  be on for the / switch to be on | ANDOR: Both ACS readers need to be on to / initially activate the  switch, but then only one / ACS reader is needed to keep it on. | Both ACS readers have a temperature sensor / from the Logical Connector | The switch's temperature sensor and pins 8/9 / are connected to the "Master" ACS reader | There is a 100mS delay on the output switch, / so that the mode can be changed mid-operation / without interrupting the system
Top Silkscreen Layer: Master | Secondary | Jim Heaney, RIT SHED Makerspace | Logical Connector | V1.1.1 | Jan 2025 | Access Control | Notes on Reverse | ANDOR | AND | OR
